# Altium schematic sheet Sheet2.SchDoc
size A
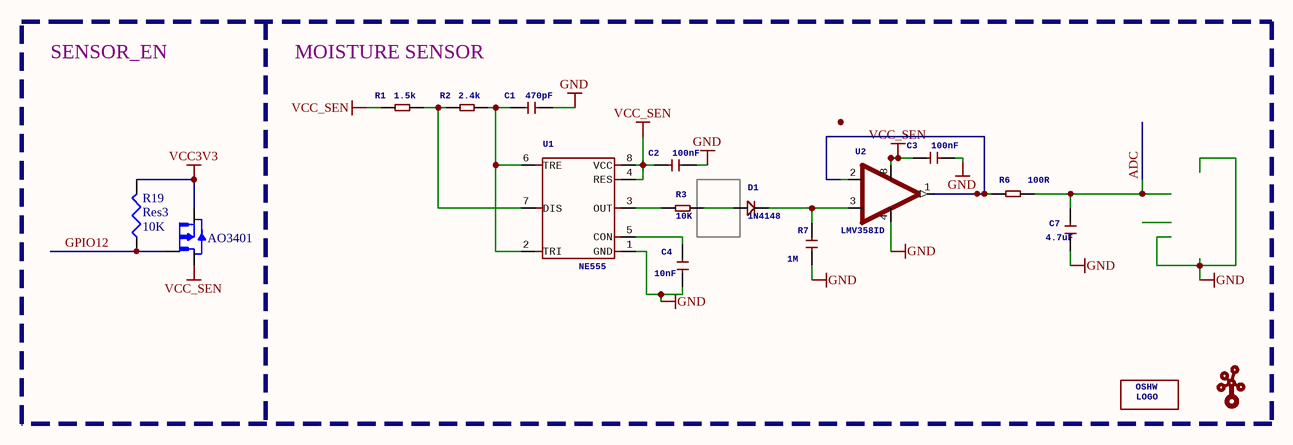
[diagram p0: Sheet2.SchDoc]

## Parts
?  AO3401  [SOT23]
C1  470pF  [C0603]
C2  100nF  [C0603]
C3  100nF  [C0603]
C4  10nF  [C0603]
C7  4.7uF  [C0603]
D1  1N4148  [LL-34]
LOGO1  LOGO-OSHW-FILLX0200-NT  [OSHW_FILLX200_NOTEXT]  (value not drawn)
R1  1.5k  [R0603]
R2  2.4k  [R0603]
R3  10K  [R0603]
R6  100R  [R0603]
R7  1M  [C0603]
R19  Res3  value 10K  [J1-0603]
U1  NE555  [SOIC8-1.27-5X4MM]
U2  LMV358ID  [SOIC8-1.27-5X4MM]
U$7  LOGO-GROVE  [GROVE-SILK-BIG]  (value not drawn)

## Nets
GND: C1.1 C2.1 C3.1 C4.2 C7.2 R7.2 U1.1(GND) U2.4(GND)
VCC3V3: ?.2(S) R19.2
VCC_SEN: ?.3(D) C2.2 C3.2 R1.2 U1.4(RES) U1.8(VCC) U2.8(+V)
ADC: C7.1 R6.2
GPIO12: ?.1(G) R19.1
NetC1_2: C1.2 R2.1 U1.2(TRI) U1.6(TRE)
NetC4_1: C4.1 U1.5(CON)
NetD1_A: D1.A(+) R3.2
NetD1_C: D1.C(-) R7.1 U2.3(+IN1)
NetR1_1: R1.1 R2.2 U1.7(DIS)
NetR3_1: R3.1 U1.3(OUT)
NetR6_1: R6.1 U2.1(OUT1) U2.2(-IN1)

## Notes on the sheet
- SENSOR_EN
- MOISTURE SENSOR

## Library data of the parts
? = AO3401: P-Channel 30V 4A _Ta_ 1.4W _Ta_ Surface Mount SOT-23-3; MF: Alpha & Omega Semiconductor; Value: *; MP: AO3401; SnapEDA_Link: https://www.snapeda.com/parts/AO3401/Alpha%20%26%20Omega%20Semiconductor/view-part/4592622/?ref=snap; Availability: Unavailable; Package: SOT-23-3 Alpha &amp; Omega Semiconductor; Price: None
C1-C4 C7 R7 = CAP-0603: Ceramic Capacitors
D1 = DIODE*'1N4148-SMD'
LOGO1 = LOGO-OSHW-FILLX0200-NT: PARTNO: DNP; OSHW: OSHW; LOGO: LOGO
R1-R3 R6 = RES-0603
R19 = Res3: Resistor; Published: 8-Jun-2000; LatestRevisionDate: 29-May-2009; LatestRevisionNote: IPC-7351 Footprint Added.; PackageReference: J1-0603; Publisher: Altium Limited; PackageDescription: Chip Resistor
U1 = CLOCK/TIMING-NE555'DR': DIP-8:310110001;SOIC-8:310110013;TSSOP-8:310110002
U2 = AMPLIFIER-LMV358'D': SOIC-8:310020002;MSOP-8:310020007
U$7 = LOGO-GROVE: PARTNO: DNP